# Altium project PCB_Project1.最小系统.PrjPCB
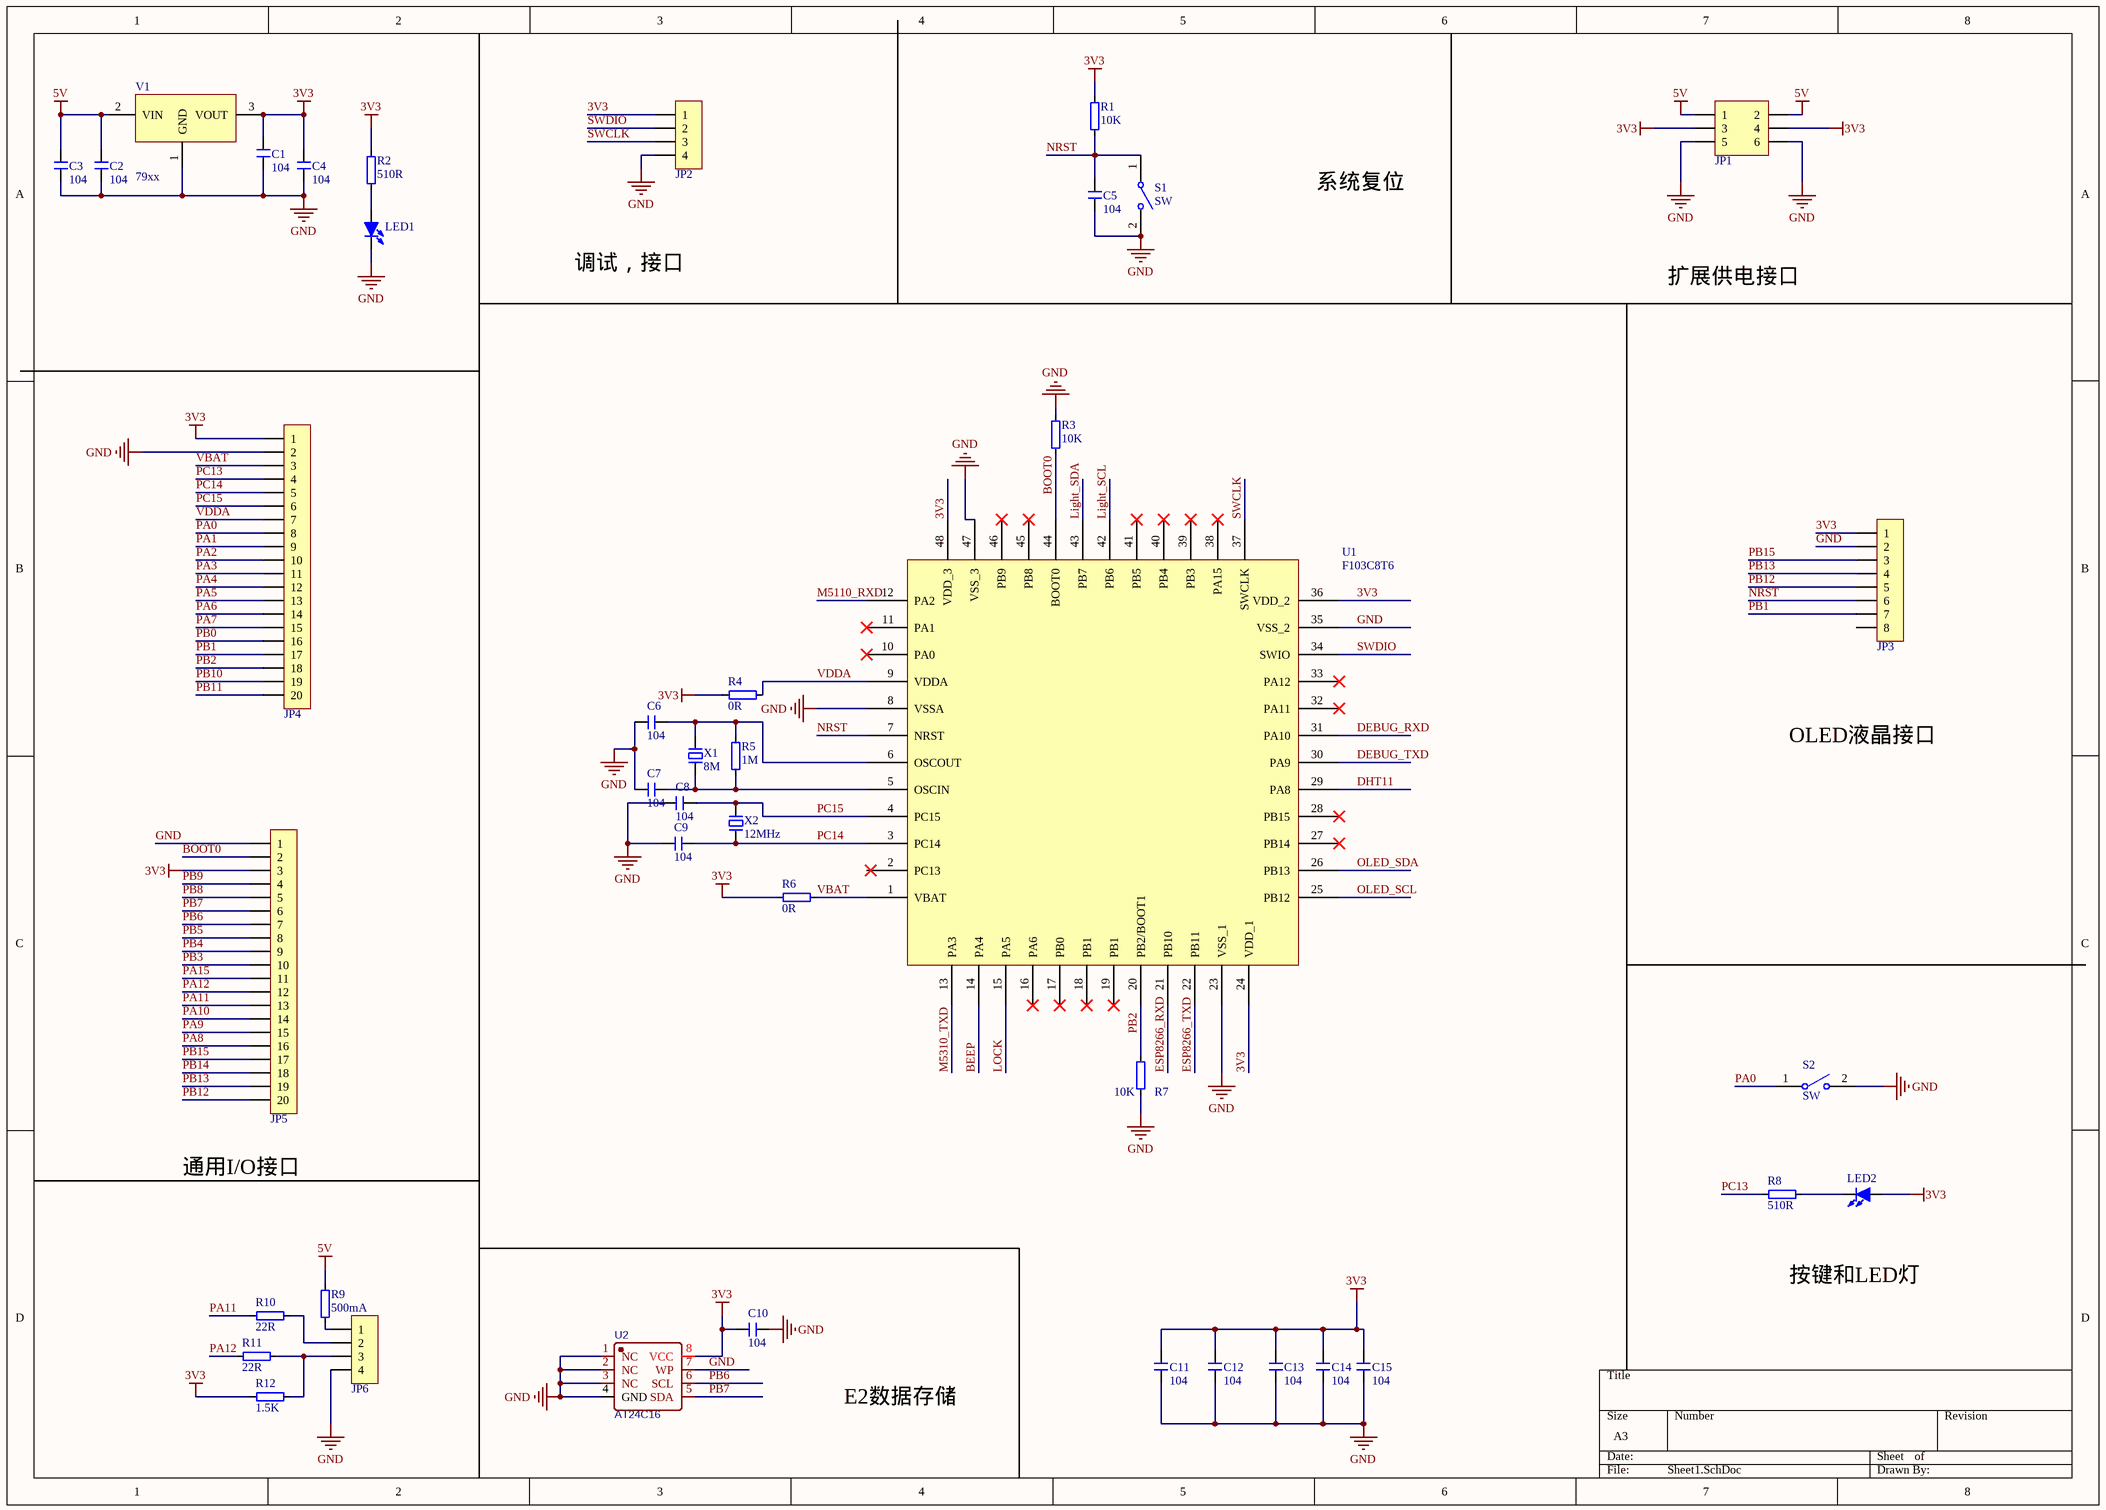
[diagram p0: Sheet1.SchDoc]
2 sheets, 76 parts. Net scope: global (net labels, ports and power ports of the same name join across sheets).
Sheets:
  Sheet1.SchDoc
  Sheet2.SchDoc

## Sheet Sheet1.SchDoc
size A3

### Parts
(Parts that share a designator on the sheet are numbered #1, #2 ... from top to bottom, then left to right.)
C1#1  104  [0603C]
C2  104  [0603C]
C3  104  [0603C]
C4#1  104  [0603C]
C5#1  104  [0603C]
C6#1  104  [0603C]
C7#1  104  [0603C]
C8#1  104  [0603C]
C9#1  104  [0603C]
C10  104  [0603C]
C11  104  [0603C]
C12  104  [0603C]
C13  104  [0603C]
C14#1  104  [0603C]
C15#1  104  [0603C]
JP1  Header3X2  [HDR2.54-LI-2x3P]  (value not drawn)
JP2  HDR-1X4  [HDR2.54-LI-4P]  (value not drawn)
JP3  HDR-1X8  [HDR2.54-LI-8P]  (value not drawn)
JP4  HDR-1X20  [HDR2.54-LI-20P]  (value not drawn)
JP5  HDR-1X20  [HDR2.54-LI-20P]  (value not drawn)
JP6  HDR-1X4  [HDR2.54-LI-4P]  (value not drawn)
LED1  (no value)  [LED 0603G]
LED2  (no value)  [LED 0603G]
R1#1  10K  [R 0603_M]
R2  510R  [R 0603_M]
R3#1  10K  [R 0603_M]
R4  0R  [R 0603_M]
R5#1  1M  [R 0603_M]
R6  0R  [R 0603_M]
R7  10K  [R 0603_M]
R8  510R  [R 0603_M]
R9  500mA  [R 0603_M]
R10  22R  [R 0603_M]
R11  22R  [R 0603_M]
R12  1.5K  [R 0603_M]
S1  SW  [TSW SMD-3*6*5]
S2  SW  [TSW SMD-3*6*5]
U1#1  F103C8T6  [LQFP-48_M]
U2  AT24C16  [SOP-8_L5.0-W4.0-P1.27-LS6.0-BL]
V1  79xx  [SOT-223]
X1#1  8M  [OSC UM-5 - duplicate]
X2#1  12MHz  [OSC UM-5 - duplicate]

### Nets
3V3: C1#1.2 C4#1.2 C10.1 C11.2 C12.2 C13.2 C14#1.2 C15#1.2 JP1.3 JP1.4 JP2.1 JP3.1 JP4.1 JP5.3 LED2.1(A) R1#1.2 R2.2 R4.1 R6.1 R12.1 U1#1.24(VDD_1) U1#1.36(VDD_2) U1#1.48(VDD_3) U2.8(VCC) V1.3(VOUT)
5V: C2.2 C3.2 JP1.1 JP1.2 R9.2 V1.2(VIN)
GND: C1#1.1 C2.1 C3.1 C4#1.1 C5#1.1 C6#1.1 C7#1.1 C8#1.2 C9#1.2 C10.2 C11.1 C12.1 C13.1 C14#1.1 C15#1.1 JP1.5 JP1.6 JP2.4 JP3.2 JP4.2 JP5.1 JP6.4 LED1.2(K) R3#1.2 R7.1 S1.2 S2.2 U1#1.8(VSSA) U1#1.23(VSS_1) U1#1.35(VSS_2) U1#1.47(VSS_3) U2.1(NC) U2.2(NC) U2.3(NC) U2.4(GND) U2.7(WP) V1.1(GND)
VDDA: JP4.7 R4.2 U1#1.9(VDDA)
BEEP: U1#1.14(PA4)
BOOT0: JP5.2 R3#1.1 U1#1.44(BOOT0)
DEBUG_RXD: U1#1.31(PA10)
DEBUG_TXD: U1#1.30(PA9)
DHT11: U1#1.29(PA8)
ESP8266_RXD: U1#1.21(PB10)
ESP8266_TXD: U1#1.22(PB11)
Light_SCL: U1#1.42(PB6)
Light_SDA: U1#1.43(PB7)
LOCK: U1#1.15(PA5)
M5110_RXD: U1#1.12(PA2)
M5310_TXD: U1#1.13(PA3)
NRST: C5#1.2 JP3.6 R1#1.1 S1.1 U1#1.7(NRST)
OLED_SCL: U1#1.25(PB12)
OLED_SDA: U1#1.26(PB13)
PA0: JP4.8 S2.1
PA1: JP4.9
PA2: JP4.10
PA3: JP4.11
PA4: JP4.12
PA5: JP4.13
PA6: JP4.14
PA7: JP4.15
PA8: JP5.16
PA9: JP5.15
PA10: JP5.14
PA11: JP5.13 R10.1
PA12: JP5.12 R11.1
PA15: JP5.11
PB0: JP4.16
PB1: JP3.7 JP4.17
PB2: JP4.18 R7.2 U1#1.20(PB2/BOOT1)
PB3: JP5.10
PB4: JP5.9
PB5: JP5.8
PB6: JP5.7 U2.6(SCL)
PB7: JP5.6 U2.5(SDA)
PB8: JP5.5
PB9: JP5.4
PB10: JP4.19
PB11: JP4.20
PB12: JP3.5 JP5.20
PB13: JP3.4 JP5.19
PB14: JP5.18
PB15: JP3.3 JP5.17
PC13: JP4.4 R8.1
PC14: C9#1.1 JP4.5 U1#1.3(PC14) X2#1.1
PC15: C8#1.1 JP4.6 U1#1.4(PC15) X2#1.2
SWCLK: JP2.3 U1#1.37(SWCLK)
SWDIO: JP2.2 U1#1.34(SWIO)
VBAT: JP4.3 R6.2 U1#1.1(VBAT)
NetC6#1_2: C6#1.2 R5#1.2 U1#1.6(OSCOUT) X1#1.2
NetC7#1_2: C7#1.2 R5#1.1 U1#1.5(OSCIN) X1#1.1
NetJP6_1: JP6.1 R9.1
NetJP6_2: JP6.2 R10.2
NetJP6_3: JP6.3 R11.2 R12.2
NetLED1_1: LED1.1(A) R2.1
NetLED2_2: LED2.2(K) R8.2

Not connected (* = marked no-connect by the designer): JP3 8; U1#1 2(PC13) 10(PA0)* 11(PA1)* 16(PA6)* 17(PB0)* 18(PB1)* 19(PB1)* 27(PB14)* 28(PB15)* 32(PA11)* 33(PA12)* 38(PA15)* 39(PB3)* 40(PB4)* 41(PB5)* 45(PB8)* 46(PB9)*

### Notes on the sheet
- 系统复位
- 调试，接口
- 扩展供电接口
- OLED液晶接口
- 通用I/O接口
- 按键和LED灯
- E2数据存储

### Library data of the parts
C1#1 C2 C3 C4#1 C5#1 C6#1 C7#1 C8#1 C9#1 C10-C13 C14#1 C15#1 = C: 无极性贴片电容; 版权归属: 源创客; BOM名称: 无极性贴片电容; 学习资源: www.ooocke.com
JP1 = Header 3X2: 3*2P接插件; 版权归属: 源创客; BOM名称: 3*2P接插件; 学习资源: www.ooocke.com
JP2 JP6 = Header 4: 4P接插件; 版权归属: 源创客; BOM名称: 4P接插件; 学习资源: www.ooocke.com
JP3 = Header 8: 8P接插件; 版权归属: 源创客; BOM名称: 8P接插件; 学习资源: www.ooocke.com
JP4 JP5 = Header 20: 20P接插件; 版权归属: 源创客; BOM名称: 20P接插件; 学习资源: www.ooocke.com
LED1 LED2 = LED-SMD: 贴片LED; 版权归属: 源创客; BOM名称: 贴片LED; 学习资源: www.ooocke.com
R1#1 R2 R3#1 R4 R5#1 R6-R12 = 普通电阻
S1 S2 = KCD1-101: 1路单刀船型开关; 版权归属: 源创客; BOM名称: 1路单刀船型开关; 学习资源: www.ooocke.com
U1#1 = STM32F103C8T6: IC
U2 = AT24C16: BOM_Manufacturer: IDCHIP; Contributor: LCSC; BOM_Supplier: LCSC; BOM_Supplier Part: C561263; BOM_Manufacturer Part: AT24C16; spicePre: U; spiceSymbolName: AT24C16
V1 = 79xx: 线性稳压芯片; 版权归属: 源创客; BOM名称: 线性稳压芯片; 学习资源: www.ooocke.com
X1#1 X2#1 = XTAL-2P: 2脚无源脚晶振; 版权归属: 源创客; BOM名称: 2脚无源脚晶振; 学习资源: www.ooocke.com

## Sheet Sheet2.SchDoc
size A4
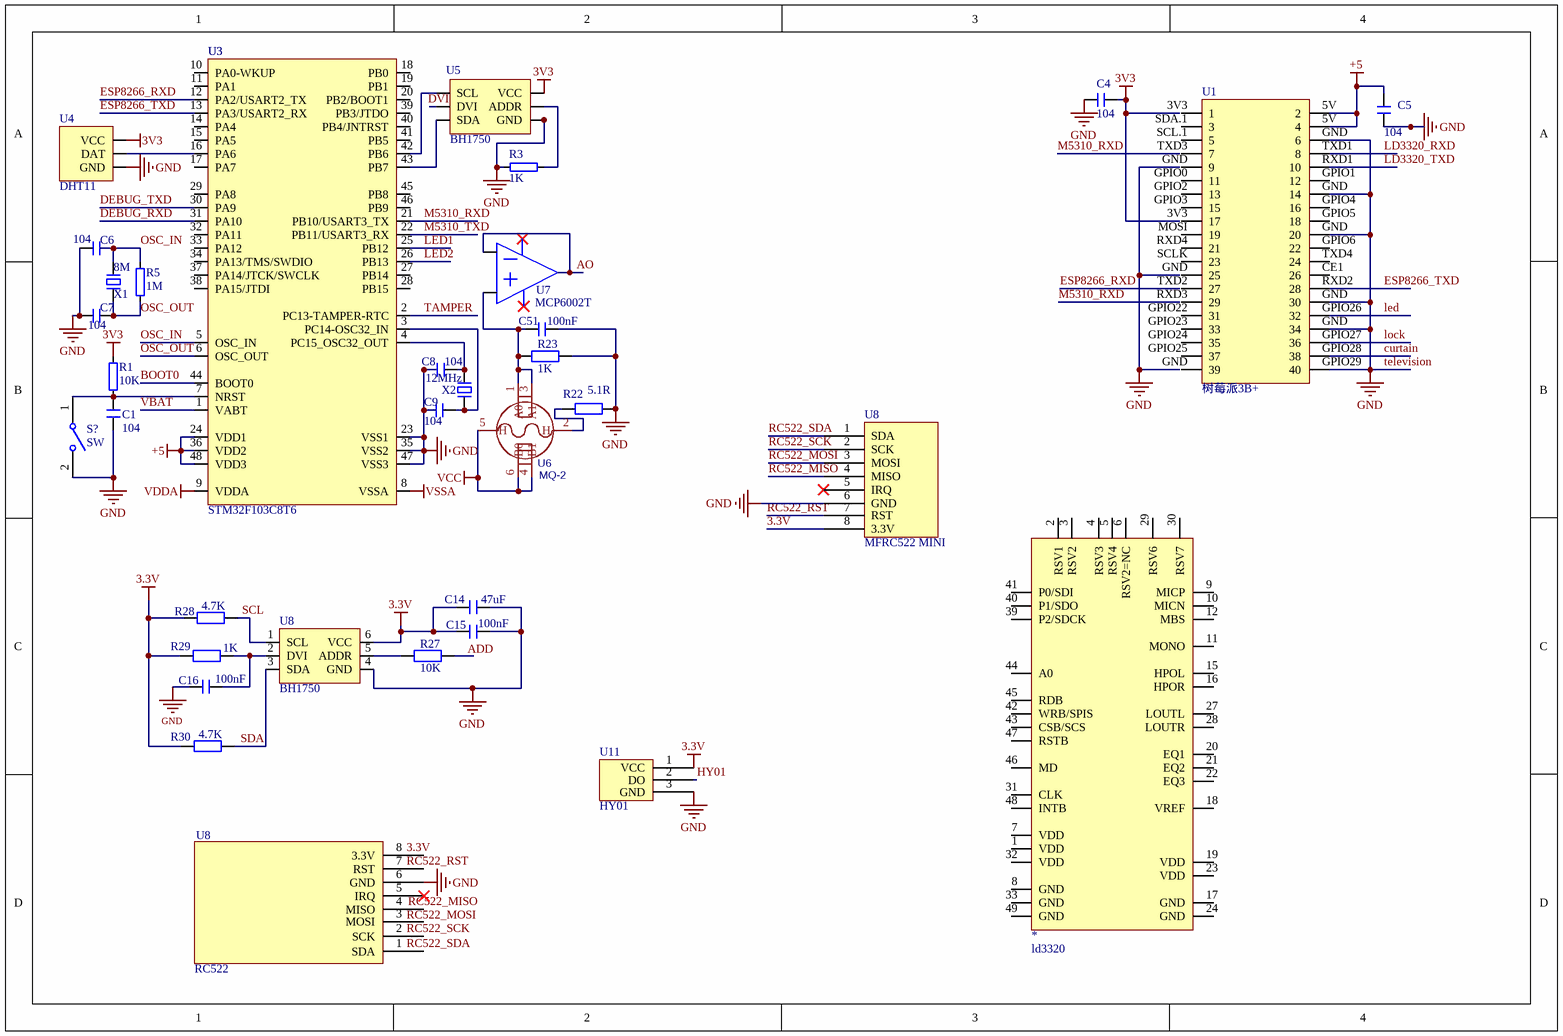
[diagram p1: Sheet2.SchDoc]

### Parts
(Parts that share a designator on the sheet are numbered #1, #2 ... from top to bottom, then left to right.)
*  ld3320
C1#2  104  [0603C]
C4#2  104  [0603C]
C5#2  104  [0603C]
C6#2  104  [0603C]
C7#2  104  [0603C]
C8#2  104  [0603C]
C9#2  104  [0603C]
C14#2  47uF  [0603C]
C15#2  100nF  [C 0805_L]
C16  100nF  [C 0805_L]
C51  100nF  [C 0805_L]
R1#2  10K  [R 0603_M]
R3#2  1K  [R 0603_M]
R5#2  1M  [R 0603_M]
R22  5.1R  [R 0805_L]
R23  1K  [R 0805_L]
R27  10K  [R 0805_L]
R28  4.7K  [R 0805_L]
R29  1K  [R 0805_L]
R30  4.7K  [R 0805_L]
S?  SW  [TSW SMD-3*6*5]
U1#2  树莓派3B+
U3  STM32F103C8T6  [LQFP-48_M]
U4  DHT11
U5  BH1750
U6  MQ-2  [SENSOR-TH_MQ-2]
U7  MCP6002T  [R 0603_M]
U8#1  MFRC522 MINI
U8#2  BH1750
U8#3  RC522  (part B of 2)
U11  HY01
X1#2  8M  [OSC UM-5 - duplicate]
X2#2  12MHz  [OSC UM-5 - duplicate]

### Nets
3.3V: C14#2.1 C15#2.2 R28.2 R29.2 R30.2 U8#1.8(3.3V) U8#2.6(VCC) U11.1(VCC)
3V3: C4#2.1 R1#2.2 U4.VCC U5.SDA.28(VCC)
+5: C5#2.1 U1#2.5V(2) U3.24(VDD1) U3.36(VDD2) U3.48(VDD3)
GND: C1#2.1 C4#2.2 C5#2.2 C6#2.1 C7#2.1 C8#2.1 C9#2.1 C14#2.2 C15#2.1 C16.2 C51.1 R3#2.2 R22.1 R23.1 S?.2 U1#2.GND(6) U1#2.GPIO29(40) U3.23(VSS1) U3.35(VSS2) U3.47(VSS3) U4.SDA.23(GND) U5.SDA.30(GND) U8#1.6(GND) U8#2.4(GND) U8#3.6(GND) U11.3(GND)  [also labelled television]
VCC: U6.4(B1) U6.5(H) U6.6(B0)
VDDA: U3.9(VDDA)
VSSA: U3.8(VSSA)
BOOT0: U3.44(BOOT0)
curtain: U1#2.GPIO28(38)
DEBUG_RXD: U3.31(PA10)
DEBUG_TXD: U3.30(PA9)
ESP8266_RXD: U3.12(PA2/USART2_TX)
ESP8266_TXD: U1#2.RXD2(28) U3.13(PA3/USART2_RX)
HY01: U11.2(DO)
LD3320_RXD: U1#2.TXD1(8)
LD3320_TXD: U1#2.RXD1(10)
led: U1#2.GPIO26(32)
LED1: U3.25(PB12)
LED2: U3.26(PB13)
LOCK: U1#2.GPIO27(36)
M5310_RXD: U3.21(PB10/USART3_TX)
M5310_TXD: U3.22(PB11/USART3_RX)
OSC_IN: C6#2.2 R5#2.2 U3.5(OSC_IN) X1#2.2
OSC_OUT: C7#2.2 R5#2.1 U3.6(OSC_OUT) X1#2.1
RC522_MISO: U8#1.4(MISO)
RC522_MOSI: U8#1.3(MOSI)
RC522_RST: U8#1.7(RST)
RC522_SCK: U8#1.2(SCK)
RC522_SDA: U8#1.1(SDA)
SCL: R28.1 U8#2.1(SCL)
SDA: R30.1 U8#2.3(SDA)
TAMPER: U3.2(PC13-TAMPER-RTC)
VBAT: U3.1(VABT)
NetC1#2_2: C1#2.2 R1#2.1 S?.1 U3.7(NRST)
NetC8#2_2: C8#2.2 U3.4(PC15_OSC32_OUT) X2#2.1
NetC9#2_2: C9#2.2 U3.3(PC14-OSC32_IN) X2#2.2
NetC16_1: C16.1 R29.1 U8#2.2(DVI)
NetC51_2: C51.2 R23.2 U6.1(A0) U6.3(A1)
NetR3#2_1: R3#2.1 U5.SDA.29(ADDR)
NetR22_2: R22.2 U6.2(H)
NetR27_2: R27.2 U8#2.5(ADDR)
NetU3_16: U3.16(PA6) U4.SDA.24(DAT)
NetU3_42: U3.42(PB6) U5.SCL
NetU3_43: U3.43(PB7) U5.SDA.27(SDA)

Not connected (* = marked no-connect by the designer): * 1(VDD) 2(RSV1) 3(RSV2) 4(RSV3) 5(RSV4) 6(RSV2=NC) 7(VDD) 8(GND) 9(MICP) 10(MICN) 11(MONO) 12(MBS) 15(HPOL) 16(HPOR) 17(GND) 18(VREF) 19(VDD) 20(EQ1) 21(EQ2) 22(EQ3) 23(VDD) 24(GND) 27(LOUTL) 28(LOUTR) 29(RSV6) 30(RSV7) 31(CLK) 32(VDD) 33(GND) 39(P2/SDCK) 40(P1/SDO) 41(P0/SDI) 42(WRB/SPIS) 43(CSB/SCS) 44(A0) 45(RDB) 46(MD) 47(RSTB) 48(INTB) 49(GND); R27 1; U1#2 3V3(1) CE1(26) GPIO0(11) GPIO1(12) GPIO2(13) GPIO3(15) GPIO4(16) GPIO5(18) GPIO6(22) GPIO22(31) GPIO23(33) GPIO24(35) GPIO25(37) MOSI(19) RXD3(29) RXD4(21) SCL.1(5) SCLK(23) SDA.1(3) TXD2(27) TXD3(7) TXD4(24); U3 10(PA0-WKUP) 11(PA1) 14(PA4) 15(PA5) 17(PA7) 18(PB0) 19(PB1) 20(PB2/BOOT1) 27(PB14) 28(PB15) 29(PA8) 32(PA11) 33(PA12) 34(PA13/TMS/SWDIO) 37(PA14/JTCK/SWCLK) 38(PA15/JTDI) 39(PB3/JTDO) 40(PB4/JNTRST) 41(PB5) 45(PB8) 46(PB9); U5 SDA.26(DVI); U8#1 5(IRQ)*; U8#3 1(SDA) 2(SCK) 3(MOSI) 4(MISO) 5(IRQ)* 7(RST) 8(3.3V)

### Notes on the sheet
- (near U3) U3
- (near U1#2) 树莓派3B+
- U8
- Labels drawn without touching a wire or pin: 3.3V, ADD, DVI, RC522_MISO, RC522_MOSI, RC522_RST, RC522_SCK, RC522_SDA

### Library data of the parts
C1#2 C4#2 C5#2 C6#2 C7#2 C8#2 C9#2 C14#2 C15#2 C16 C51 = C: 无极性贴片电容; 版权归属: 源创客; BOM名称: 无极性贴片电容; 学习资源: www.ooocke.com
R1#2 R3#2 R5#2 U7 = 普通电阻
R22 R23 R27-R30 = R: 贴片电阻; 版权归属: 源创客; BOM名称: 贴片电阻; 学习资源: www.ooocke.com
S? = KCD1-101: 1路单刀船型开关; 版权归属: 源创客; BOM名称: 1路单刀船型开关; 学习资源: www.ooocke.com
U1#2 = pi
U3 = STM32F103C8T6: IC
U6 = MQ-2: BOM_Manufacturer: Winsen; BOM_Paste Type: expand; BOM_Supplier: LCSC; BOM_Manufacturer Part: MQ-2; BOM_Supplier Part: C99296; spicePre: U; spiceSymbolName: MQ-2
U8#1 = RC522
X1#2 X2#2 = XTAL-2P: 2脚无源脚晶振; 版权归属: 源创客; BOM名称: 2脚无源脚晶振; 学习资源: www.ooocke.com

## Nets that join several sheets
3V3: Sheet1 (25 pins), Sheet2 (C4#2.1 R1#2.2 U4.VCC U5.SDA.28)
GND: Sheet1 (37 pins), Sheet2 (26 pins)
VDDA: Sheet1 (JP4.7 R4.2 U1#1.9), Sheet2 (U3.9)
BOOT0: Sheet1 (JP5.2 R3#1.1 U1#1.44), Sheet2 (U3.44)
DEBUG_RXD: Sheet1 (U1#1.31), Sheet2 (U3.31)
DEBUG_TXD: Sheet1 (U1#1.30), Sheet2 (U3.30)
ESP8266_RXD: Sheet1 (U1#1.21), Sheet2 (U3.12)
ESP8266_TXD: Sheet1 (U1#1.22), Sheet2 (U1#2.RXD2 U3.13)
LOCK: Sheet1 (U1#1.15), Sheet2 (U1#2.GPIO27)
M5310_TXD: Sheet1 (U1#1.13), Sheet2 (U3.22)
VBAT: Sheet1 (JP4.3 R6.2 U1#1.1), Sheet2 (U3.1)